# EAGLE schematic labwiz-module_servo_dual (EAGLE 6.5.0)

## Sheet 1 of 2
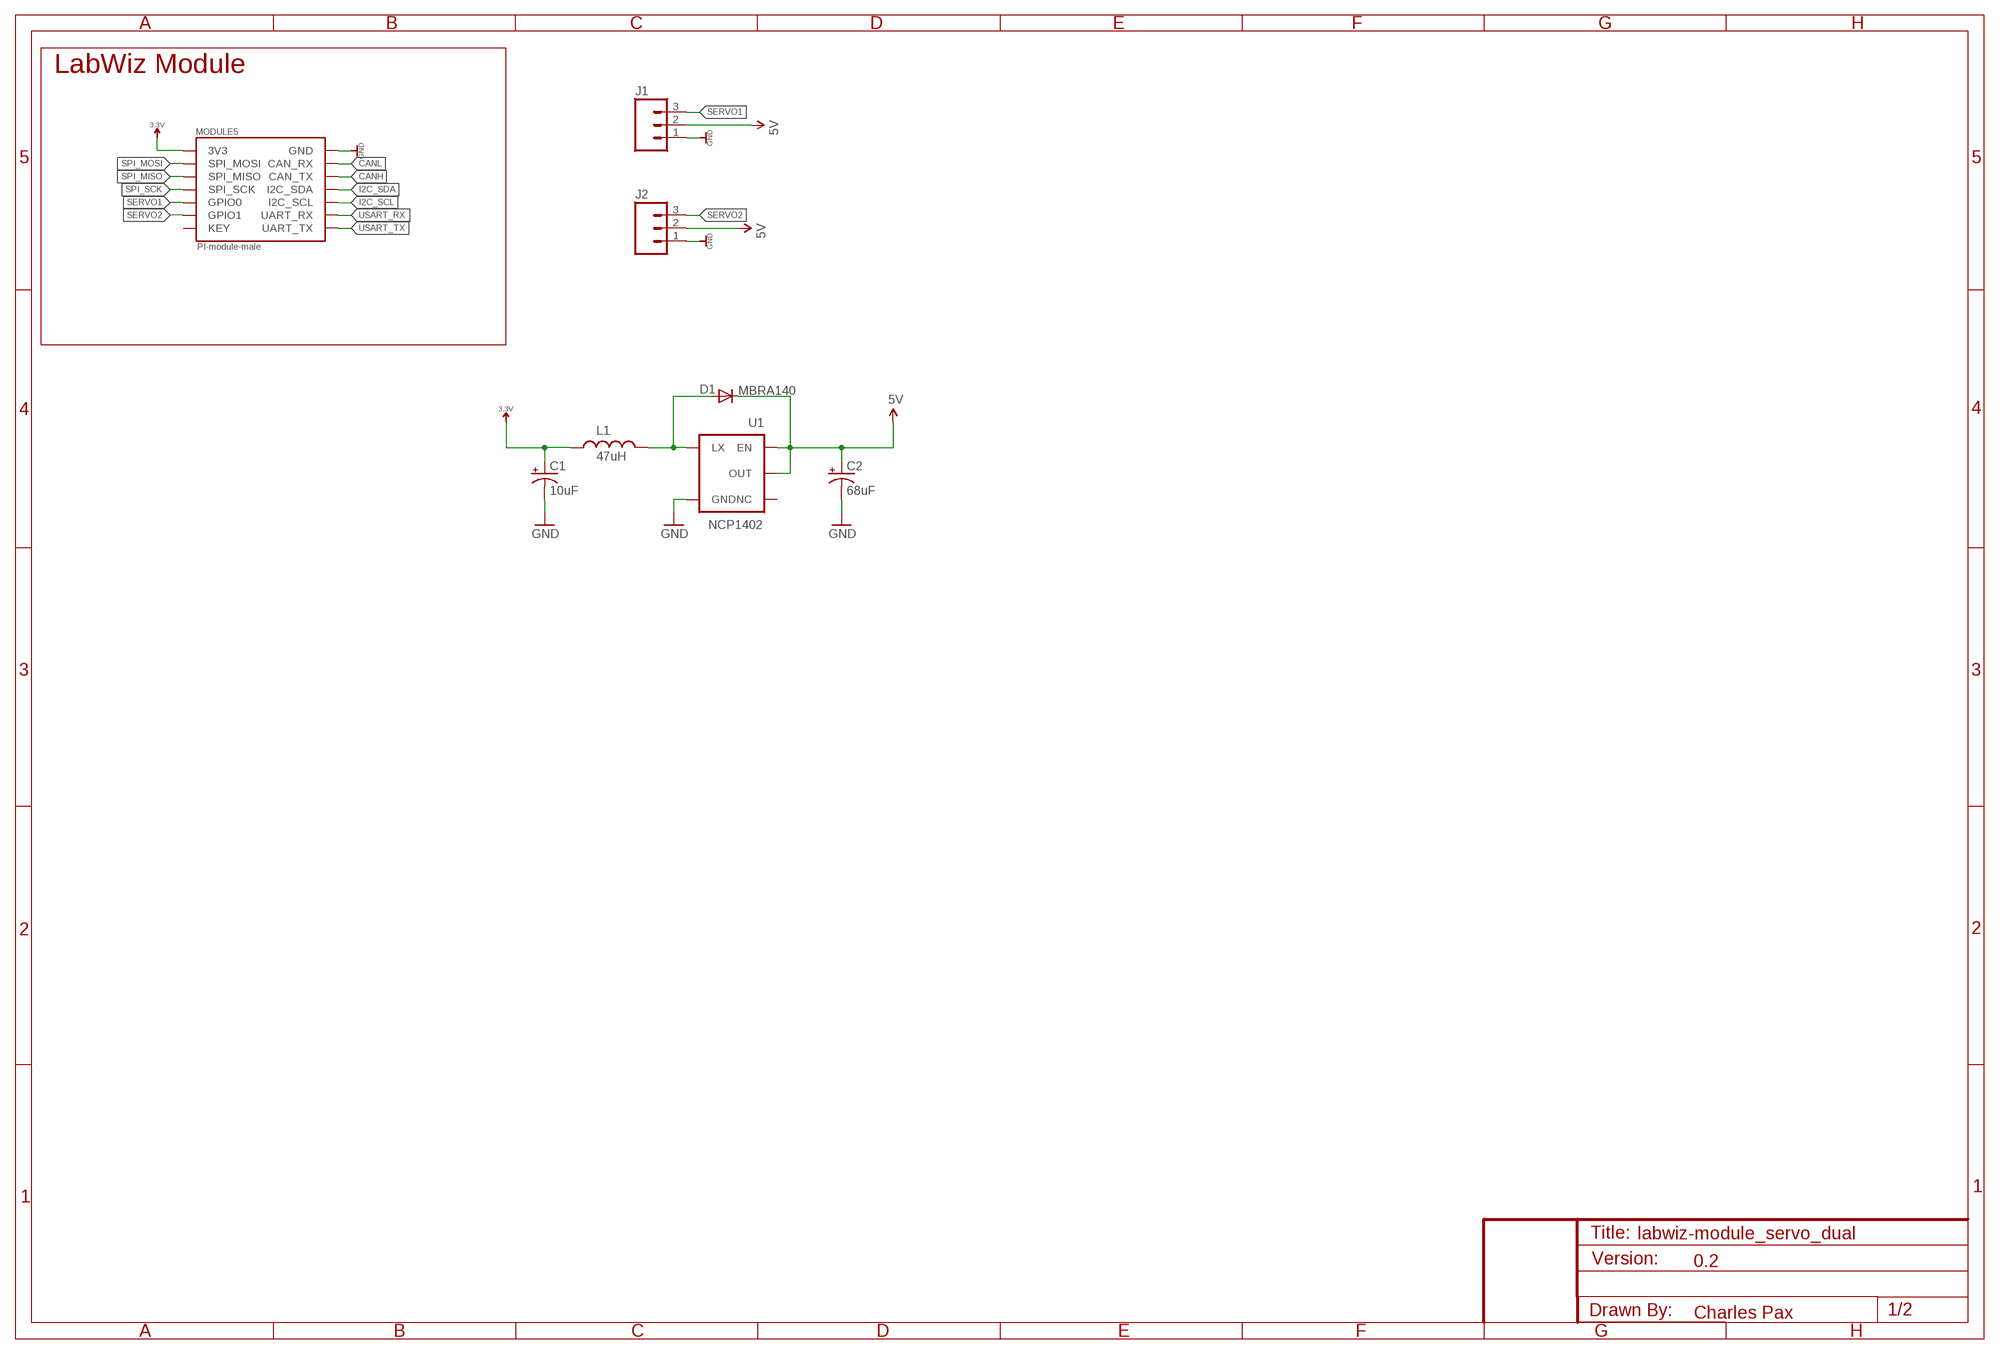
[diagram p0: schematic, sheet 1]

### Parts
C1  10uF  CAP_POL1206  [EIA3216]
C2  68uF  CAP_POL3528  [EIA3528]
D1  MBRA140  DIODESMA  [SMA-DIODE]
J1  M031X03_SMD_RA_MALE_POST_SMALLEST  [1X03_SMD_RA_MALE_POST_SMALLEST]
J2  M031X03_SMD_RA_MALE_POST_SMALLEST  [1X03_SMD_RA_MALE_POST_SMALLEST]
L1  47uH  INDUCTORCR54  [CR54]
MODULE5  PI-module-male  PAX_MODULE_EDGE_MALE_MODULE  [M07X2_2MM_EDGE]
U1  NCP1402  V_REG_NCP1400SOT23-5  [SOT23-5]

### Nets
3.3V: C1.A(+) L1.P$1 MODULE5.P$13(3V3)
5V: C2.A(+) D1.C J1.2 J2.2 U1.1(EN) U1.2(OUT)
CANH: MODULE5.P$10(CAN_TX)
CANL: MODULE5.P$12(CAN_RX)
GND: C1.C(-) C2.C(-) J1.1 J2.1 MODULE5.P$14(GND) U1.4(GND)
I2C_SCL: MODULE5.P$6(I2C_SCL)
I2C_SDA: MODULE5.P$8(I2C_SDA)
N$1: D1.A L1.P$2 U1.5(LX)
SERVO1: J1.3 MODULE5.P$5(GPIO0)
SERVO2: J2.3 MODULE5.P$3(GPIO1)
SPI_MISO: MODULE5.P$9(SPI_MISO)
SPI_MOSI: MODULE5.P$11(SPI_MOSI)
SPI_SCK: MODULE5.P$7(SPI_SCK)
USART_RX: MODULE5.P$4(UART_RX)
USART_TX: MODULE5.P$2(UART_TX)
Unconnected: MODULE5.P$1(KEY) U1.3(NC)

### Notes on the sheet
- LabWiz Module
- 0.2
- Charles Pax

## Sheet 2 of 2

## Library data of the parts
C1 C2 = SparkFun:CAP_POL: Capacitor Polarized These are standard SMD and PTH capacitors. Normally 10uF, 47uF, and 100uF in electrolytic and tantalum varieties. Always verify the external diameter of the through hole cap, it varies with capacity, voltage, and manufacturer. The EIA devices should be standard.
D1 = SparkFun:DIODE: Diode These are standard reverse protection diodes and small signal diodes. SMA package can handle up to about 1A. SOD-323 can handle about 200mA. What the SOD-323 package when ordering, there are some mfgs out there that are 5-pin packages.
J1 J2 = SparkFun-Connectors:M03: Header 3 Standard 3-pin 0.1" header. Use with straight break away headers (SKU : PRT-00116), right angle break away headers (PRT-00553), swiss pins (PRT-00743), machine pins (PRT-00117), and female headers (PRT-00115). Molex polarized connector foot print use with SKU : PRT-08232 with associated crimp pins and housings.
L1 = SparkFun:INDUCTOR: Inductors Basic Inductor/Choke - 0603 and 1206. Footprints are not proven and vary greatly between part numbers.
MODULE5 = PaxInstruments-Connectors:PAX_MODULE; MF: Pax Instruments; MPN: PIxxxx
U1 = SparkFun:V_REG_NCP1400: Switching step-up voltage regulator NCP1400 switiching regulator takes single cell AA and outputs 100mA at 3.3V or 5V with minimal number of external components.

## Net classes
0 Digital signal: width 0.1 mm, drill 0.2 mm, clearance 0.15 mm
1 3.3V power: width 0.1 mm, drill 0.2 mm, clearance 0.15 mm
2 RTC battery: width 0.1 mm, drill 0.2 mm, clearance 0.15 mm
3 5V power: width 0.1 mm, drill 0.2 mm, clearance 0.15 mm
4 Analog signal: width 0.1 mm, drill 0.2 mm, clearance 0.15 mm
5 GND: width 0.1 mm, drill 0.2 mm, clearance 0.15 mm